# Altium schematic sheet OSC_24MHZ.SchDoc: 24MHz Oscillator
size A4; Organization: Altium Limited.; Address1: Level 3, 12a Rodborough Rd; Address2: Frenchs Forest 2086; Address3: NSW; Address4: AUSTRALIA; DocumentNumber: 50; SheetNumber: 51; SheetTotal: 78
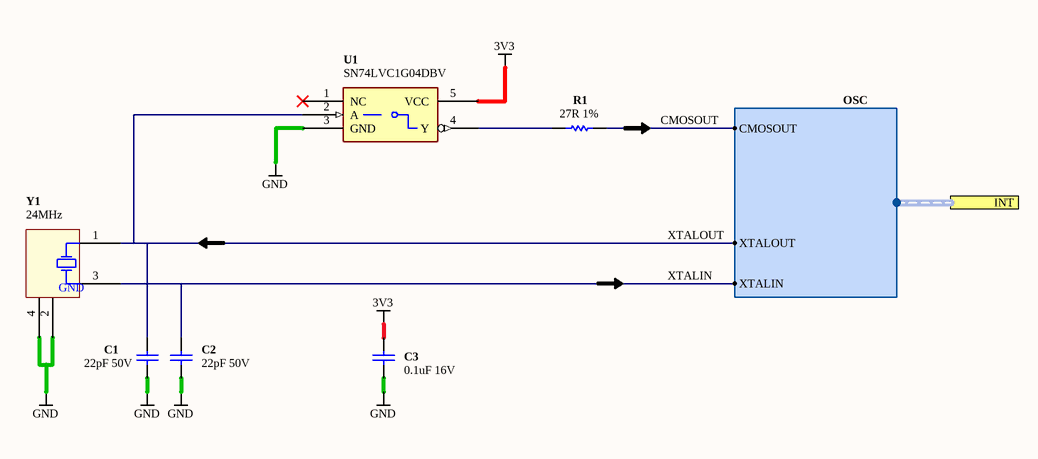
[diagram p0: OSC_24MHZ.SchDoc]

## Parts
C1  22pF 50V  [CAPC1005-STAR]
C2  22pF 50V  [CAPC1005-STAR]
C3  0.1uF 16V  [CAPC1005-STAR]
R1  27R 1%  [RESC1005-STAR]
U1  SN74LVC1G04DBV  [SOT95P280-5]
Y1  24MHz  [XTAL-200X126-4]

## Ports
INT (harness OSC)

## Harnesses
OSC: CMOSOUT, XTALIN, XTALOUT

## Nets
3V3: C3.1 U1.5(VCC)
GND: C1.2 C2.2 C3.2 U1.3(GND) Y1.2(GND) Y1.4(GND)
CMOSOUT: R1.1 ; port INT.CMOSOUT
XTALIN: C2.1 Y1.3(X2) ; port INT.XTALIN
XTALOUT: C1.1 U1.2(A) Y1.1(X1) ; port INT.XTALOUT
NetR1_2: R1.2 U1.4(Y)

Not connected (* = marked no-connect by the designer): U1 1(NC)*

## Notes on the sheet
- Sheet Title
- Project Title
- Size:
- Date:
- A4
- Assy:
- Time:
- Revision:
- Sheet
- of
- File:

## Library data of the parts
C1 C2 = D-101-0059: Capacitor, Ceramic, 22pF 5% 50V 0402 (1005) COG; Polarity: Non-Polarized; Category: Capacitor; Capacitance: 22 pF; Dielectric: COG; Mounting Technology: Surface Mount; Rated Voltage: 50 V; Status: Unreleased; Technology: Ceramic; Tolerance: 5 %
C3 = D-101-0080: Capacitor, Ceramic, 0.1uF 10% 16V 0402 (1005) X7R; Polarity: Non-Polarized; Category: Capacitor; Capacitance: 0.1 uF; Dielectric: X7R; Mounting Technology: Surface Mount; Rated Voltage: 16 V; Status: Production; Technology: Ceramic; Tolerance: 10 %
R1 = D-100-0108: Resistor, 27R 1% 0402 (1005); Power Rating: 63 mW; Category: Resistor; Mounting Technology: Surface Mount; Resistance: 27 R; Status: Production; Tolerance: 1 %
U1 = D-205-0001: SN74LVC1G04DBV, Single Inverter Gate, 1.65-V to 5.5-V; Mounting Technology: Surface Mount; Status: Production; Category: IC-Logic
Y1 = D-103-0013: Crystal, SMD, 24.000000MHz Stab=30ppm 20.0pF; Frequency Stability: 30 ppm; Load Capacitance: 20 pF; Nominal Operational Voltage: mV; Category: Crystal; Frequency Tolerance: 30 ppm; Mounting Technology: Surface Mount; Nominal Fequency: 24 MHz; Status: Unreleased